# Altium schematic sheet MCU.SchDoc
size B; SheetNumber: 3; SheetTotal: 5
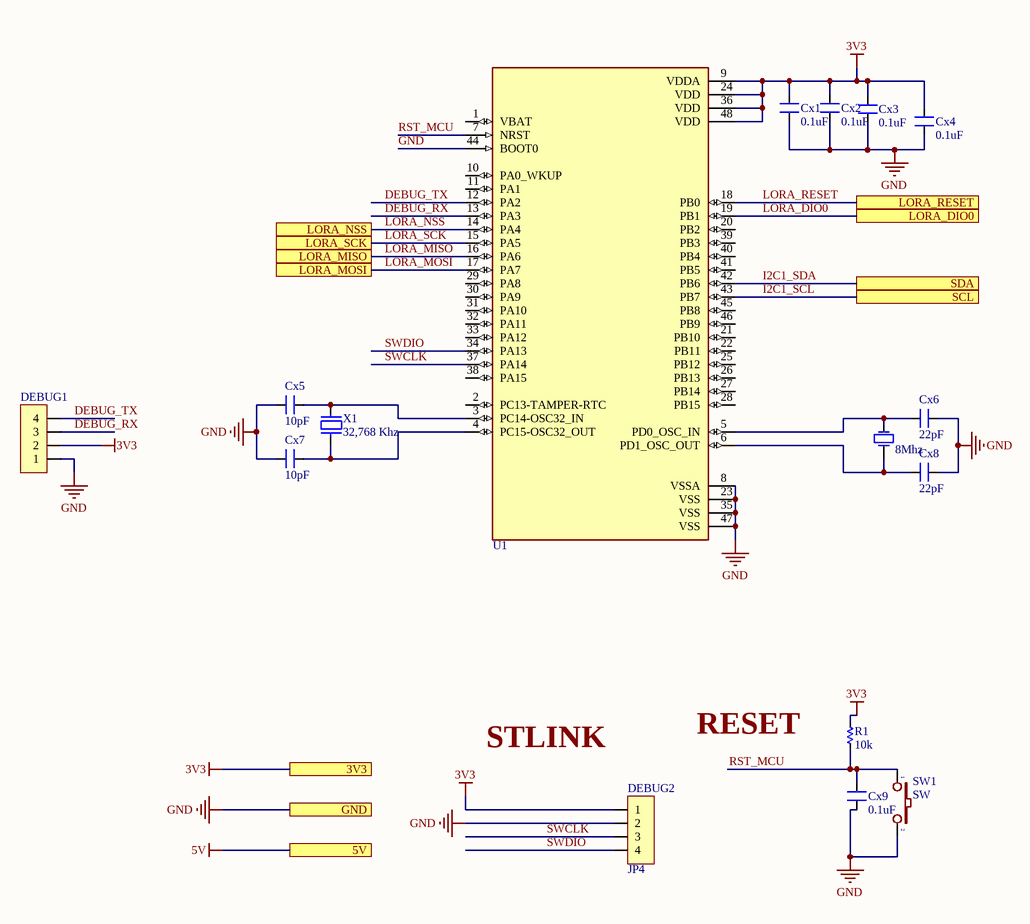
[diagram p0: MCU.SchDoc]

## Parts
Cx1  0.1uF  [CN-SMD-0805]
Cx2  0.1uF  [CN-SMD-0805]
Cx3  0.1uF  [CN-SMD-0805]
Cx4  0.1uF  [CN-SMD-0805]
Cx5  10pF  [CN-SMD-0805]
Cx6  22pF  [CN-SMD-0805]
Cx7  10pF  [CN-SMD-0805]
Cx8  22pF  [CN-SMD-0805]
Cx9  0.1uF  [CN-SMD-0805]
DEBUG1  (no value)  [JP4-C1T]
DEBUG2  JP4  [JP4-C1T]
R1  10k  [RES-SMD-0805]
SW1  SW  [SW1-SMD]
U1  STM32  [LQFP48_L]  (value not drawn)
X1  32,768 Khz  [XT32kn]
Y1  8Mhz  [XT2]

## Ports
3V3, 5V, GND, LORA_DIO0, LORA_MISO, LORA_MOSI, LORA_NSS, LORA_RESET, LORA_SCK, SCL, SDA

## Nets
3V3: Cx1.2 Cx2.2 Cx3.2 Cx4.2 DEBUG1.2 DEBUG2.1 R1.1 U1.9(VDDA) U1.24(VDD) U1.36(VDD) U1.48(VDD) ; port 3V3
5V: port 5V
GND: Cx1.1 Cx2.1 Cx3.1 Cx4.1 Cx5.1 Cx6.2 Cx7.1 Cx8.2 Cx9.1 DEBUG1.1 DEBUG2.2 SW1.2 U1.8(VSSA) U1.23(VSS) U1.35(VSS) U1.44(BOOT0) U1.47(VSS) ; port GND
DEBUG_RX: DEBUG1.3 U1.13(PA3)
DEBUG_TX: DEBUG1.4 U1.12(PA2)
I2C1_SCL: U1.43(PB7) ; port SCL
I2C1_SDA: U1.42(PB6) ; port SDA
LORA_DIO0: U1.19(PB1) ; port LORA_DIO0
LORA_MISO: U1.16(PA6) ; port LORA_MISO
LORA_MOSI: U1.17(PA7) ; port LORA_MOSI
LORA_NSS: U1.14(PA4) ; port LORA_NSS
LORA_RESET: U1.18(PB0) ; port LORA_RESET
LORA_SCK: U1.15(PA5) ; port LORA_SCK
RST_MCU: Cx9.2 R1.2 SW1.1 U1.7(NRST)
SWCLK: DEBUG2.3 U1.37(PA14)
SWDIO: DEBUG2.4 U1.34(PA13)
NetCx5_2: Cx5.2 U1.3(PC14-OSC32_IN) X1.2
NetCx6_1: Cx6.1 U1.5(PD0_OSC_IN) Y1.1(OSC1)
NetCx7_2: Cx7.2 U1.4(PC15-OSC32_OUT) X1.1
NetCx8_1: Cx8.1 U1.6(PD1_OSC_OUT) Y1.2(OSC2)

Not connected (* = marked no-connect by the designer): U1 1(VBAT) 2(PC13-TAMPER-RTC) 10(PA0_WKUP) 11(PA1) 20(PB2) 21(PB10) 22(PB11) 25(PB12) 26(PB13) 27(PB14) 28(PB15) 29(PA8) 30(PA9) 31(PA10) 32(PA11) 33(PA12) 38(PA15) 39(PB3) 40(PB4) 41(PB5) 45(PB8) 46(PB9)

## Notes on the sheet
- STLINK
- RESET

## Library data of the parts
Cx1-Cx4 Cx9 = CN: Value: 33pF
Cx5 Cx7 = CN_2: recommended 12.5pF; Value: 33pF
Cx6 Cx8 = CN_5: Value: 33pF
DEBUG1 DEBUG2 = JP4: WR-PHD 2.54 mm Angled Socket Header; Manufacturer: W¨¹rth Elektronik eiSos GmbH; partNo: 613004143121; ComponentLink1 Description: Manufacturer; ComponentLink2 Description: Datasheet; NoPins: 04; Created Date: 29 March 2013; ComponentLink1URL: http://www.we-online.com; ComponentLink2URL: http://katalog.we-online.de/em/datasheet/6130xx143121.pdf; Created by: Karrer Zheng
R1 = Res-SMD: Resistor; Manufacturer: Generic Components; Class: Passive; Published: 08/06/2000; Publisher: Altium Hobart Technology Centre
SW1 = SW2: Switch button 2 pin; Value: SW chip 2 pin
U1 = STM32F103C8T6: STM32 ARM-based 32-bit MCU with 64 Kbytes Flash, 64-pin LQFP, Industrial Temperature
X1 = XT32k: Crystal 32,768kHz for timer real; Value: 32,768khz
Y1 = Thach Anh 8Mhz DIP: Cắm; Don_Vi: Con; Ghi_Chu: *; Ma_Hang: *; Kieu_CHan: *; Chung_Loai: Cắm